# EAGLE design circuito_centrale (EAGLE 9.6.2)
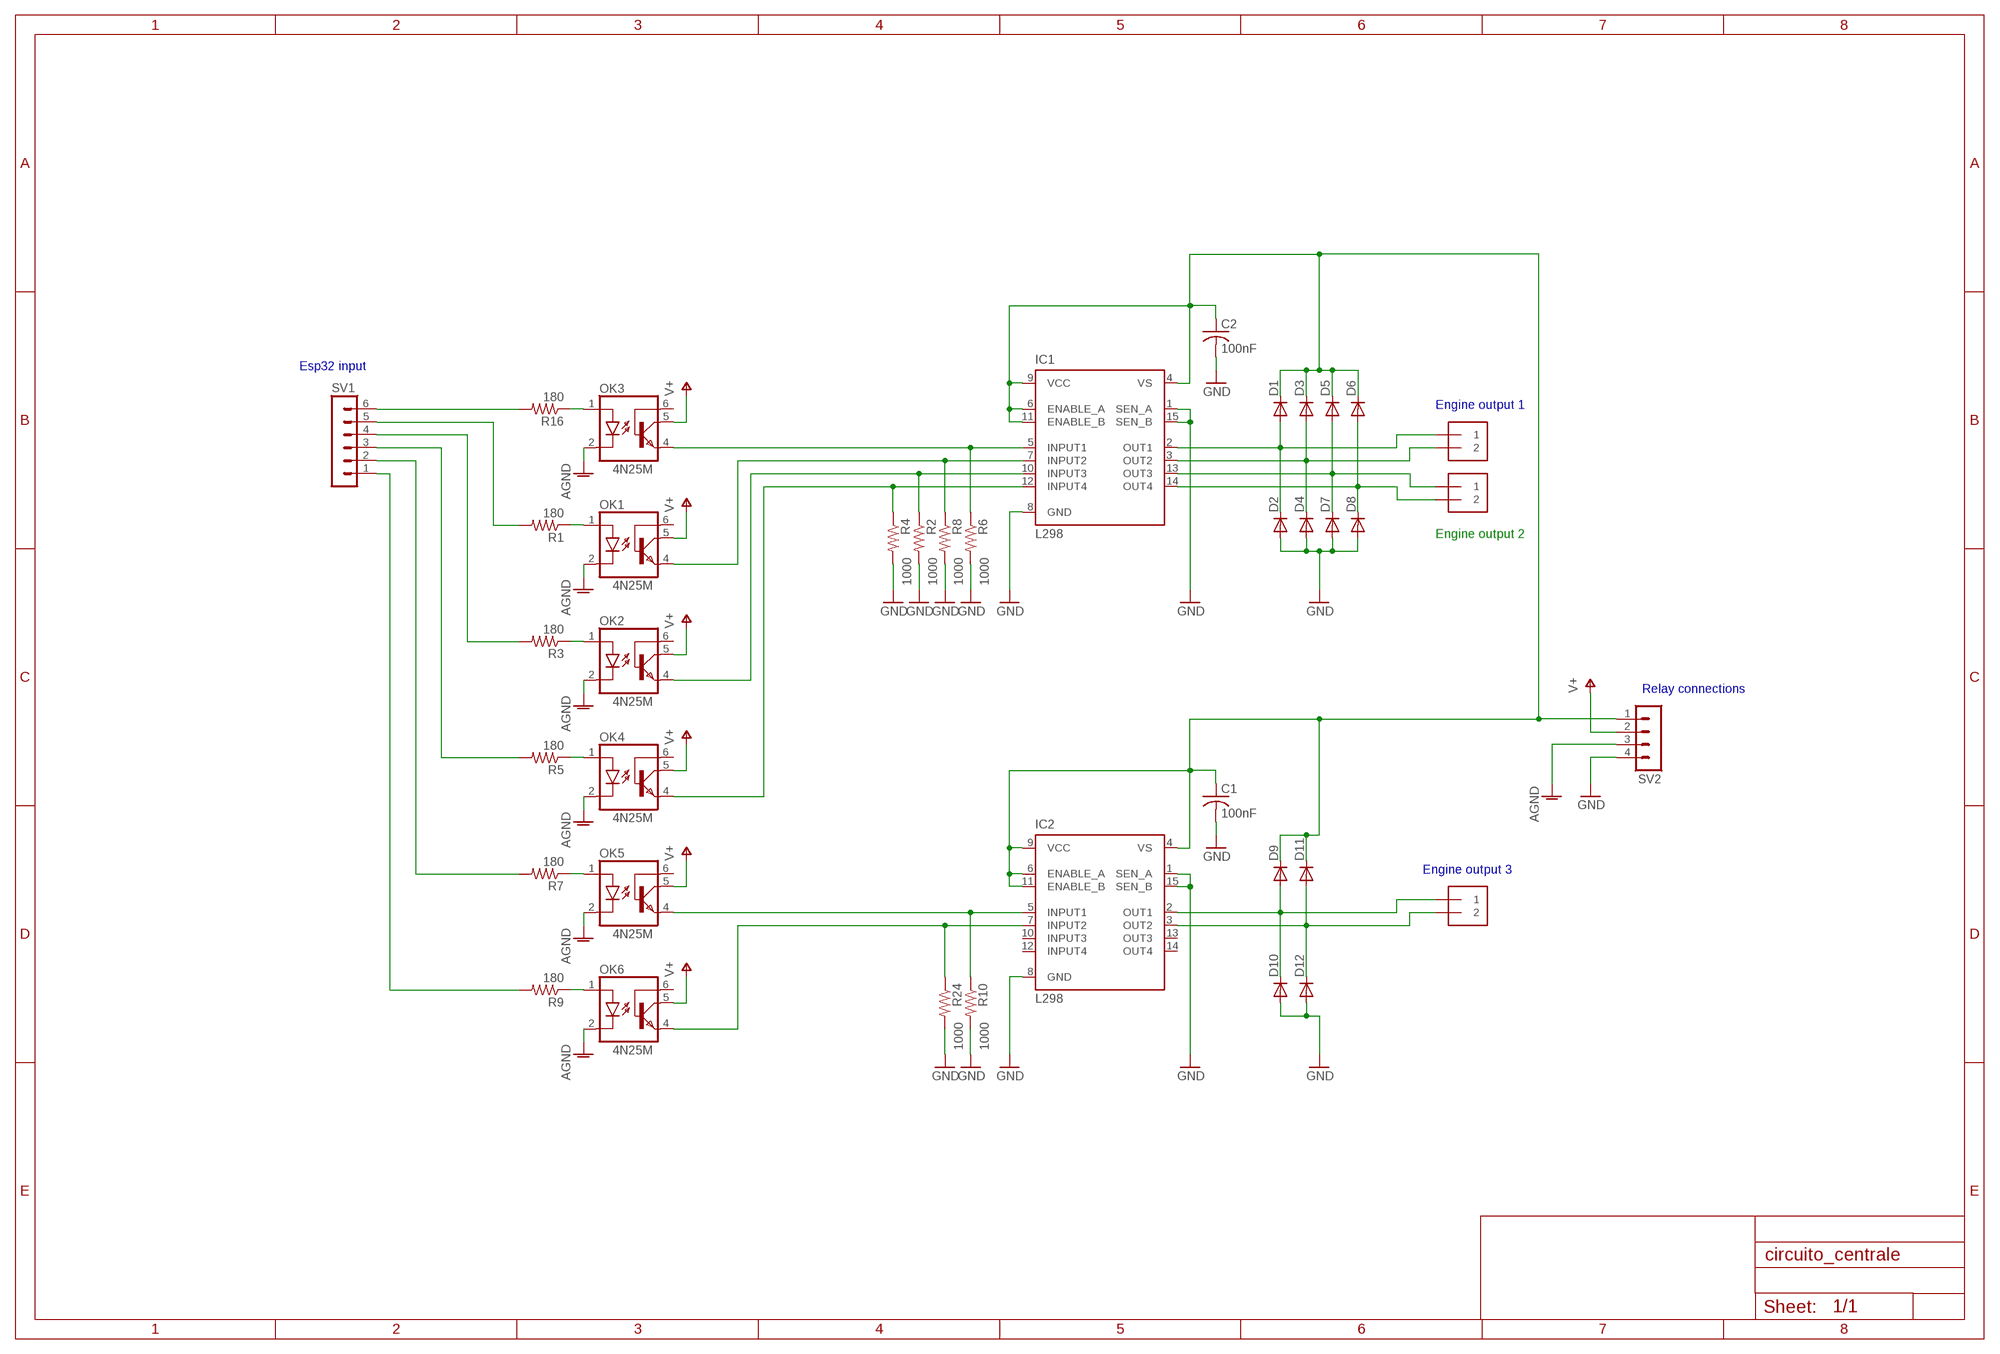
[diagram p0: schematic, sheet 1]

## Parts
C1  100nF  C-US050-024X044  [C050-024X044]
C2  100nF  C-US050-024X044  [C050-024X044]
D1  DIODE-D-5  [D-5]
D2  DIODE-D-5  [D-5]
D3  DIODE-D-5  [D-5]
D4  DIODE-D-5  [D-5]
D5  DIODE-D-5  [D-5]
D6  DIODE-D-5  [D-5]
D7  DIODE-D-5  [D-5]
D8  DIODE-D-5  [D-5]
D9  DIODE-D-5  [D-5]
D10  DIODE-D-5  [D-5]
D11  DIODE-D-5  [D-5]
D12  DIODE-D-5  [D-5]
IC1  L298  [MULTIWATT-15]
IC2  L298  [MULTIWATT-15]
J2  1X2-3.5MM  [1X2-3.5MM]
J3  1X2-3.5MM  [1X2-3.5MM]
J5  1X2-3.5MM  [1X2-3.5MM]
OK1  4N25M  [DIL06]
OK2  4N25M  [DIL06]
OK3  4N25M  [DIL06]
OK4  4N25M  [DIL06]
OK5  4N25M  [DIL06]
OK6  4N25M  [DIL06]
R1  180  R-US_0207/10  [0207/10]
R2  1000  R-US_0207/10  [0207/10]
R3  180  R-US_0207/10  [0207/10]
R4  1000  R-US_0207/10  [0207/10]
R5  180  R-US_0207/10  [0207/10]
R6  1000  R-US_0207/10  [0207/10]
R7  180  R-US_0207/10  [0207/10]
R8  1000  R-US_0207/10  [0207/10]
R9  180  R-US_0207/10  [0207/10]
R10  1000  R-US_0207/10  [0207/10]
R16  180  R-US_0207/10  [0207/10]
R24  1000  R-US_0207/10  [0207/10]
SV1  MA06-1  [MA06-1]
SV2  MA04-1  [MA04-1]

## Nets
AGND [GND1]: OK1.2(C) OK2.2(C) OK3.2(C) OK4.2(C) OK5.2(C) OK6.2(C) SV2.3
GND [GND1]: C1.2 C2.2 D2.A D4.A D7.A D8.A D10.A D12.A IC1.1(SEN_A) IC1.8(GND) IC1.15(SEN_B) IC2.1(SEN_A) IC2.8(GND) IC2.15(SEN_B) R2.2 R4.2 R6.2 R8.2 R10.2 R24.2 SV2.4
N$1: D1.A D2.C IC1.2(OUT1) J2.1
N$2: D3.A D4.C IC1.3(OUT2) J2.2
N$3: D6.A D8.C IC1.14(OUT4) J3.2
N$4: D5.A D7.C IC1.13(OUT3) J3.1
N$6: IC1.5(INPUT1) OK3.4(EMI) R6.1
N$7: OK1.1(A) R1.1
N$8: R1.2 SV1.5
N$9: IC1.7(INPUT2) OK1.4(EMI) R8.1
N$10: IC1.10(INPUT3) OK2.4(EMI) R2.1
N$11: OK2.1(A) R3.1
N$12: R3.2 SV1.4
N$13: IC1.12(INPUT4) OK4.4(EMI) R4.1
N$14: IC2.5(INPUT1) OK5.4(EMI) R10.1
N$15: OK4.1(A) R5.1
N$16: R5.2 SV1.3
N$17: IC2.7(INPUT2) OK6.4(EMI) R24.1
N$19: D9.A D10.C IC2.2(OUT1) J5.1
N$20: D11.A D12.C IC2.3(OUT2) J5.2
N$21: R7.2 SV1.2
N$22: OK3.1(A) R16.1
N$23: R16.2 SV1.6
N$24: R9.2 SV1.1
N$26: OK5.1(A) R7.1
N$29: OK6.1(A) R9.1
N$39: C1.1 C2.1 D1.C D3.C D5.C D6.C D9.C D11.C IC1.4(VS) IC1.6(ENABLE_A) IC1.9(VCC) IC1.11(ENABLE_B) IC2.4(VS) IC2.6(ENABLE_A) IC2.9(VCC) IC2.11(ENABLE_B) SV2.1
V+: OK1.5(COL) OK2.5(COL) OK3.5(COL) OK4.5(COL) OK5.5(COL) OK6.5(COL) SV2.2
Unconnected: IC2.10(INPUT3) IC2.12(INPUT4) IC2.13(OUT3) IC2.14(OUT4) OK1.6(BAS) OK2.6(BAS) OK3.6(BAS) OK4.6(BAS) OK5.6(BAS) OK6.6(BAS)

## Notes on the sheet
- Esp32 input
- Engine output 1
- Engine output 2
- Relay connections
- Engine output 3

## Library data of the parts
C1 C2 = rcl:C-US: CAPACITOR, American symbol
D1-D12 = diode:DIODE-: DIODE
IC1 IC2 = st-microelectronics:L298: DUAL FULL-BRIDGE DRIVER; MPN: L298N; OC_FARNELL: 1589425; OC_NEWARK: 32M1527
J2 J3 J5 = adafruit:1X2: 3.5mm Terminal block http://www.ladyada.net/library/pcb/eaglelibrary.html
OK1-OK6 = optocoupler:4N*?M: General Purpose 6-Pin Phototransistor Optocouplers Source: http://www.fairchildsemi.com/ds/4N/4N35-M.pdf; MPN: 4N25-M; OC_FARNELL: 1021349; OC_NEWARK: 98K9084
R1-R10 R16 R24 = rcl:R-US_: RESISTOR, American symbol; SPICEPREFIX: R
SV1 = con-lstb:MA06-1: PIN HEADER; OC_FARNELL: unknown; OC_NEWARK: unknown
SV2 = con-lstb:MA04-1: PIN HEADER; OC_FARNELL: unknown; OC_NEWARK: unknown

## Net classes
0 default: clearance 0.205 mm
1 GND1: clearance 0.205 mm to class 0, clearance 0.205 mm

## Board
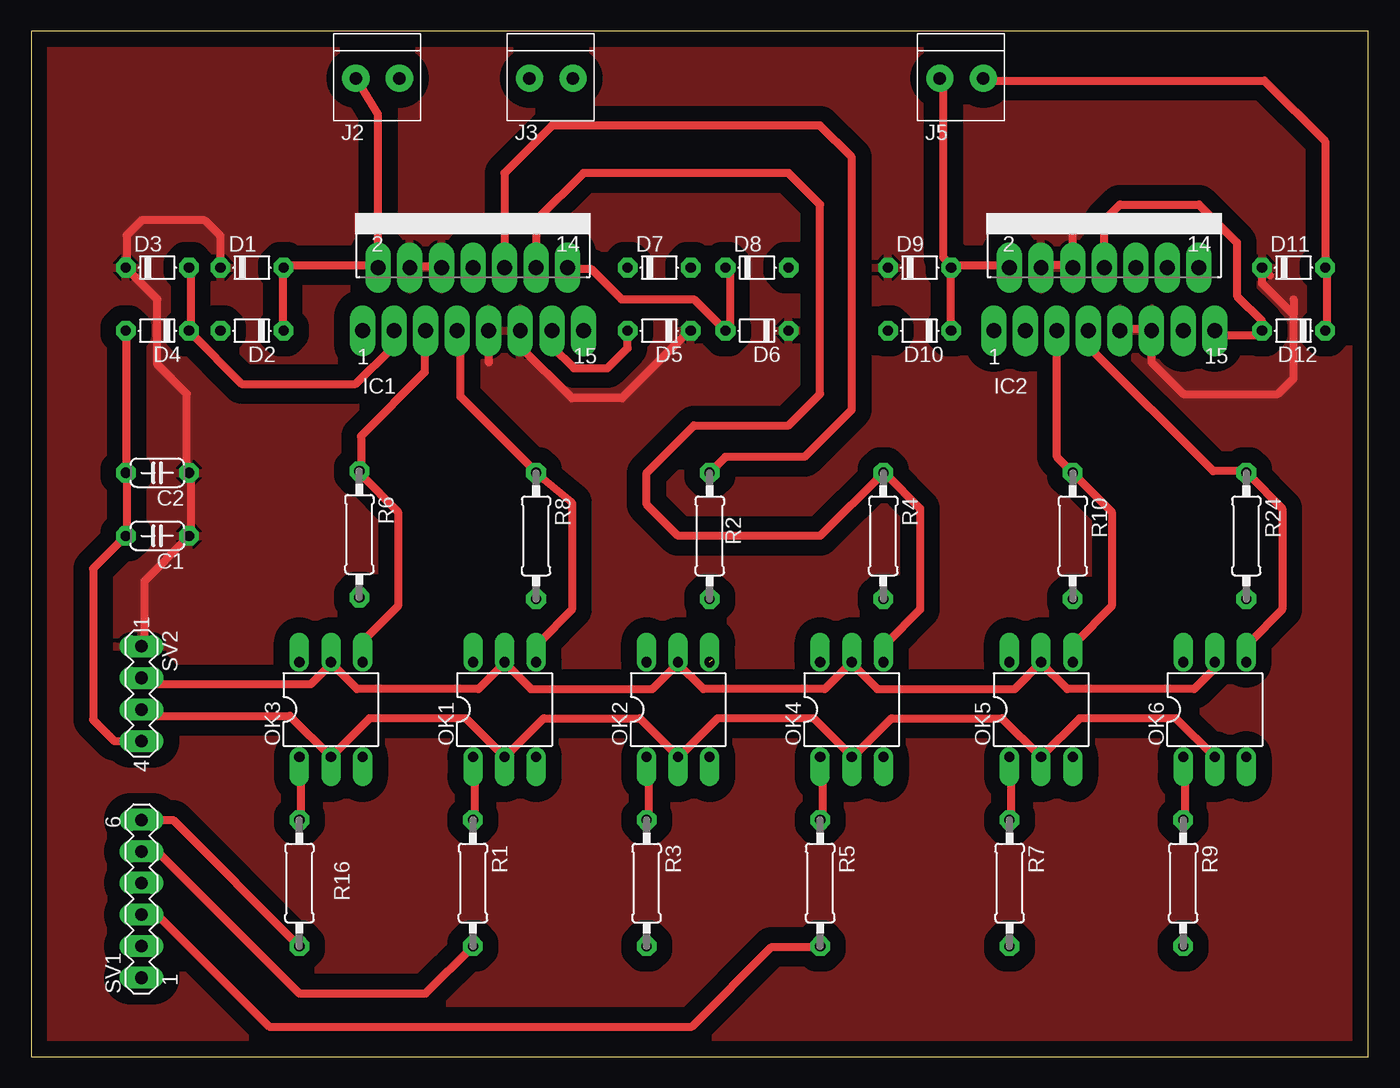
[diagram p1: board, top side]
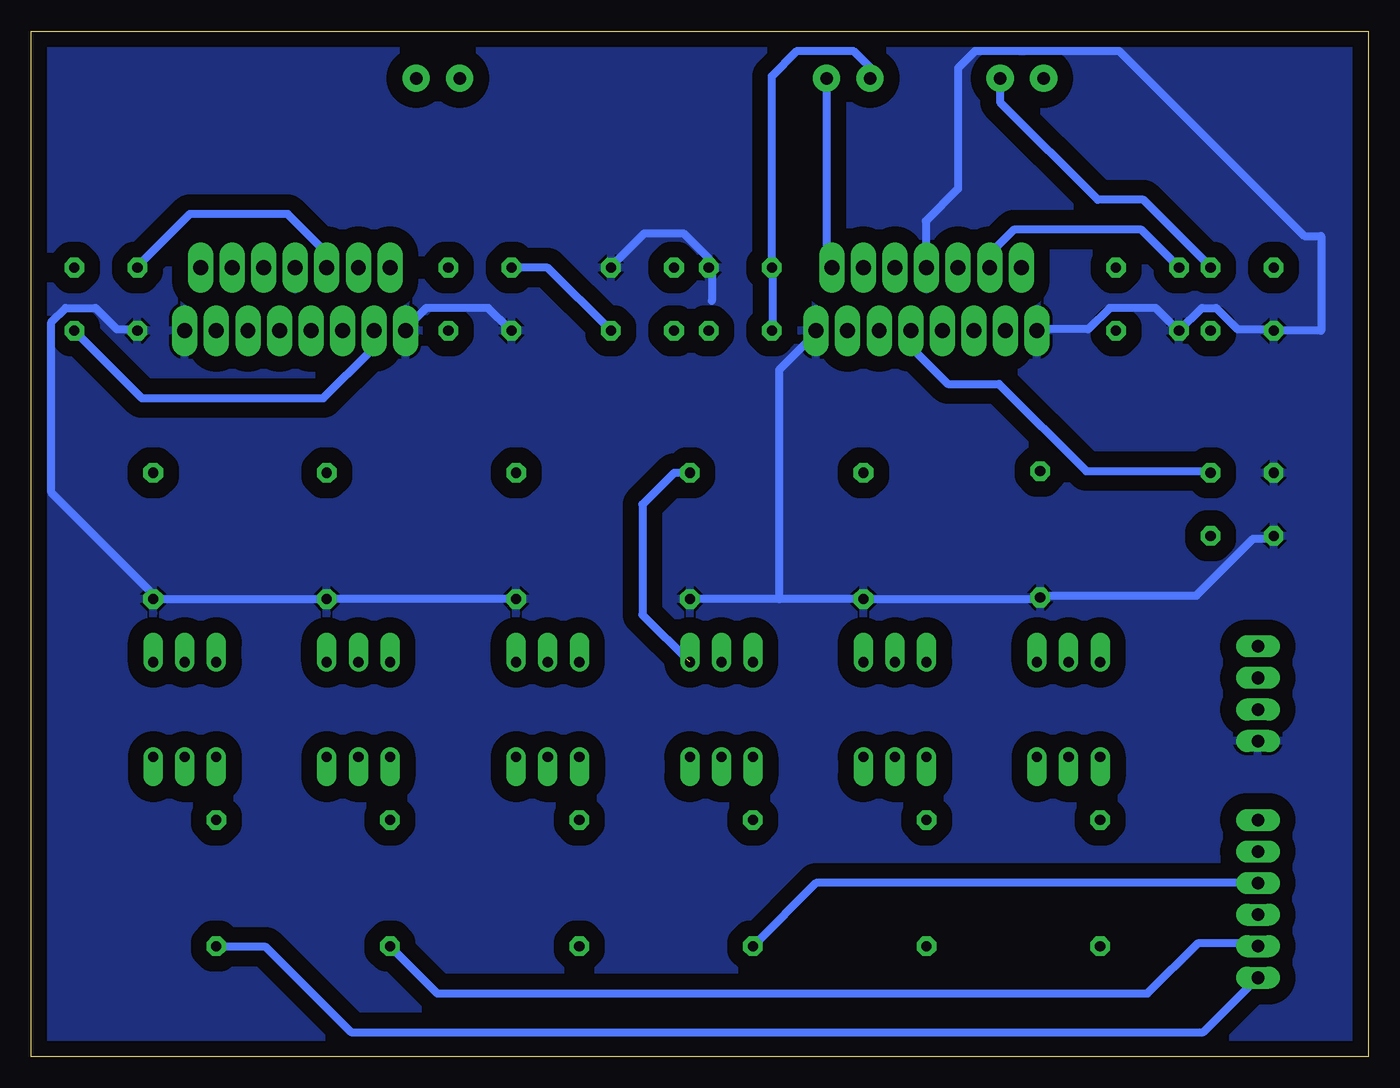
[diagram p2: board, bottom side, seen from below]

Size 107.62 x 82.54 mm. Coordinates in mm from the lower left corner, seen from the top.
Outline: 0,0 107.62,0 107.62,82.54 0,82.54 0,0
Copper layers (1*16): Top 0.035mm / dielectric 1.5mm / Bottom 0.035mm
Design rules "default *": minimum track width 25mil, minimum drill 0.35mm, track to track 20mil, track to pad 20mil, pad to pad 20mil, via to via 20mil, smd to smd 6mil, copper to edge 40mil, drill to drill 6mil, minimum pad ring 15mil, minimum via ring 15mil, stop-mask expansion 4mil, vias tented up to drill 0mil, thermal gap 10mil

### Footprints (pad centres in the part's own frame; a part is rotated, then mirrored left to right if it is on the bottom)
C050-024X044 = drill 0.813 octagon: 1 -2.54,0; 2 2.54,0
D-5 = drill 0.813 octagon: A 2.54,0; C -2.54,0
MULTIWATT-15 = drill 1.2 long: 1 -8.89,-7.62; 2 -7.62,-2.54; 3 -6.35,-7.62; 4 -5.08,-2.54; 5 -3.81,-7.62; 6 -2.54,-2.54; 7 -1.27,-7.62; 8 0,-2.54; 9 1.27,-7.62; 10 2.54,-2.54; 11 3.81,-7.62; 12 5.08,-2.54; 13 6.35,-7.62; 14 7.62,-2.54; 15 8.89,-7.62
1X2-3.5MM = drill 1 pad 2.184: 1 1.8,0; 2 -1.7,0
DIL06 = drill 0.813 offset: 1 -2.54,-3.81; 2 0,-3.81; 3 2.54,-3.81; 4 2.54,3.81; 5 0,3.81; 6 -2.54,3.81
0207/10 = drill 0.813 octagon: 1 -5.08,0; 2 5.08,0
MA06-1 = drill 1.016 long: 1 -6.35,0; 2 -3.81,0; 3 -1.27,0; 4 1.27,0; 5 3.81,0; 6 6.35,0
MA04-1 = drill 1.016 long: 1 -3.81,0; 2 -1.27,0; 3 1.27,0; 4 3.81,0

### Placement (x,y rotation side)
C1  10.16,41.91 180 top
C2  10.16,46.99 180 top
D1  17.78,63.5 0 top
D2  17.78,58.42 180 top
D3  10.16,63.5 0 top
D4  10.16,58.42 180 top
D5  50.55,58.42 180 top
D6  58.42,58.42 180 top
D7  50.55,63.5 0 top
D8  58.42,63.5 0 top
D9  71.5,63.5 0 top
D10  71.5,58.42 180 top
D11  101.6,63.5 0 top
D12  101.6,58.42 180 top
IC1  35.56,66.04 0 top
IC2  86.36,66.04 0 top
J2  27.94,78.74 180 top
J3  41.91,78.74 180 top
J5  74.93,78.74 180 top
OK1  38.1,27.94 0 top
OK2  52.07,27.94 0 top
OK3  24.13,27.94 0 top
OK4  66.04,27.94 0 top
OK5  81.28,27.94 0 top
OK6  95.25,27.94 0 top
R1  35.56,13.97 270 top
R2  54.61,41.91 270 top
R3  49.53,13.97 270 top
R4  68.58,41.91 270 top
R5  63.5,13.97 270 top
R6  26.42,42.04 270 top
R7  78.74,13.97 270 top
R8  40.64,41.91 270 top
R9  92.71,13.97 270 top
R10  83.82,41.91 270 top
R16  21.59,13.97 270 top
R24  97.79,41.91 270 top
SV1  8.89,12.7 90 top
SV2  8.89,29.21 270 top

### Tracks (layer width: path | path; a pad name or v marks a point on that pad's centre or on a via)
AGND
  Top 0.635: OK6.2 92.14,27.24 84.39,27.24 OK5.2 81.12,24.26 78.14,27.24 69.25,27.24 66.26,24.26 OK4.2 65.98,24.26 62.99,27.24 55.24,27.24 52.26,24.26 OK2.2 51.98,24.26 48.99,27.24 41.24,27.24 38.26,24.26 OK1.2 34.99,27.24 27.24,27.24 OK3.2 20.83,27.43 9.4,27.43 SV2.3 9.11,27.69
GND
  Top 0.635: SV2.4 6.7,25.4 4.98,27.11 4.98,39.27 C1.2 7.68,41.97 7.68,46.83 C2.2 7.68,47.12 7.68,58.26 D4.A | IC2.15 95.63,58.04 98.68,58.04 D12.A 99.06,59.18 97.03,61.21 97.03,65.53 93.98,68.58 87.63,68.58 86.36,67.31 IC2.8
  Bottom 0.635: D8.A 60.83,63.69 58.26,66.26 55.12,66.26 53.09,64.23 D7.A 52.83,63.41 52.83,60.83 | IC1.15 44.45,58.23 47.4,55.28 47.4,36.83 | IC2.1 77.47,58.61 75.82,60.26 70.83,60.26 69.12,58.55 D10.A | IC1.1 26.54,58.55 22.54,58.55 20.83,60.26 17.11,60.26 15.4,58.55 D2.A 13.4,60.26 12.26,60.26 10.54,58.55 7.68,58.55 D4.A 3.81,58.42 3.81,66.04 5.15,66.04 20.07,80.95 31.63,80.95 33.02,79.56 33.02,69.85 35.62,67.25 35.62,63.56 IC1.8 | 47.4,36.83 R8.2 26.54,36.83 R6.2 26.26,37.12 13.84,37.12 9.27,41.69 7.68,41.69 C1.2 | 47.4,36.83 R2.2 | R4.2 R10.2 R24.2 97.7,37.12 105.98,45.4 105.98,59.12 104.84,60.26 102.43,60.26 100.71,58.55 99.12,58.55 D12.A
  pour Bottom (isolate 1.27): 0,82.55 107.95,82.55 107.95,0 0,0
N$1
  Top 0.635: D2.C 20.26,58.55 20.26,63.41 D1.A 20.54,63.69 27.53,63.69 27.59,63.76 27.69,63.69 | 27.69,63.69 27.91,63.69 27.91,75.87 J2.1 | 27.69,63.69 IC1.2
N$2
  Top 0.635: D3.A 12.83,63.41 12.83,58.55 D4.C 12.83,58.26 16.95,54.13 26.13,54.13 29.11,57.12 29.11,58.26 IC1.3
  Bottom 0.635: J2.2 29.64,76.82 21.78,68.96 18.1,68.96 12.83,63.69 D3.A
N$3
  Top 0.635: D8.C 56.23,63.15 56.23,58.89 D6.A 53.34,60.96 47.5,60.96 45.05,63.41 43.4,63.41 IC1.14 43.69,63.69
  Bottom 0.635: J3.2 43.61,63.93 IC1.14
N$4
  Top 0.635: IC1.13 41.97,58.26 41.97,57.12 43.69,55.4 46.39,55.4 48.01,57.02 D5.A
  Bottom 0.635: D5.A 47.97,58.55 47.97,63.41 D7.C 48.01,78.92 45.97,80.95 41.46,80.95 40.13,79.63 40.13,78.76 J3.1
N$6
  Top 0.635: IC1.5 31.69,58.26 31.69,55.09 26.54,49.94 26.54,47.12 R6.1 26.54,46.83 29.53,43.85 29.53,36.26 26.83,33.56 26.83,31.97 OK3.4
N$7
  Top 0.635: R1.1 35.69,19.11 35.69,23.97 OK1.1
N$8
  Top 0.635: SV1.5 10.16,16.51 21.59,5.08 31.75,5.08 R1.2
N$9
  Top 0.635: OK1.4 40.83,31.97 40.83,33.27 43.53,35.97 43.53,44.58 R8.1 40.55,47.12 34.54,53.12 34.54,58.26 IC1.7
N$10  (1 unrouted)
  Top 0.635: 54.83,32 54.83,31.97 | R2.1 55.88,48.26 62.23,48.26 66.04,52.07 66.04,72.39 63.5,74.93 41.91,74.93 38.1,71.12 IC1.10
  Bottom 0.635: R2.1 55.88,46.99 58.42,44.45 58.42,35.56 OK2.4
N$11
  Top 0.635: R3.1 49.69,19.11 49.69,23.97 OK2.1
N$12
  Bottom 0.635: SV1.4 44.45,13.97 R3.2
N$13
  Top 0.635: OK4.4 68.83,31.97 68.83,33.27 71.53,35.97 71.53,44.13 68.83,46.83 R4.1 | 40.55,63.69 IC1.12 40.64,67.31 44.45,71.12 60.96,71.12 63.5,68.58 63.5,53.34 60.96,50.8 53.34,50.8 49.53,46.99 49.53,44.45 52.07,41.91 63.5,41.91 R4.1 | 68.55,47.12 R4.1
N$14
  Top 0.635: OK5.4 83.98,31.97 83.98,33.27 86.96,36.26 86.96,43.85 R10.1 82.55,48.26 IC2.5
N$15
  Top 0.635: R5.1 63.69,19.11 63.69,23.97 OK4.1
N$16
  Top 0.635: R5.2 63.41,8.83 59.59,8.83 53.18,2.41 19.18,2.41 10.16,11.43 SV1.3
N$17
  Top 0.635: OK6.4 97.98,31.97 97.98,33.27 100.68,35.97 100.68,44.13 97.98,46.83 R24.1 97.7,47.12 95.12,47.12 85.12,57.12 85.12,58.26 IC2.7
N$19
  Top 0.635: D10.C 73.98,58.55 73.98,63.41 D9.A | IC2.2 78.55,63.69 74.26,63.69 D9.A | J5.1 73.41,78.55 73.41,64.33 74.1,63.63 D9.A
N$20
  Top 0.635: D12.C 104.27,58.55 104.27,63.41 D11.A 104.14,73.66 99.25,78.55 76.84,78.55 J5.2
  Bottom 0.635: D12.C 98.71,52.99 84.11,52.99 80.26,56.83 80.26,58.26 IC2.3
N$21
  Bottom 0.635: 78.55,9.11 R7.2 74.93,5.08 17.78,5.08 13.75,9.11 9.11,9.11 SV1.2
N$22
  Top 0.635: R16.1 21.68,19.11 21.68,23.97 OK3.1
N$23
  Top 0.635: SV1.6 11.43,19.05 R16.2
N$24
  Bottom 0.635: SV1.1 13.27,1.97 81.88,1.97 88.74,8.83 92.55,8.83 R9.2
N$26
  Top 0.635: R7.1 78.84,19.11 78.84,23.97 OK5.1
N$29
  Top 0.635: R9.1 92.84,19.11 92.84,23.97 OK6.1
N$39
  Top 0.635: SV2.1 9.11,33.12 9.11,38.26 12.54,41.69 C1.1 12.83,41.97 12.83,46.83 C2.1 12.54,47.12 12.54,53.34 10.16,55.72 10.16,60.96 D3.C 7.68,63.69 7.68,66.1 8.89,67.31 13.97,67.31 15.24,66.04 D1.C 15.11,63.69 | IC1.4 30.5,63.56 32.96,63.56 IC1.6 | IC2.9 87.69,58.55 89.98,58.55 IC2.11 90.17,55.88 92.71,53.34 100.33,53.34 101.6,54.61 101.6,59.69 | IC2.4 81.41,63.69 83.69,63.69 IC2.6 | 39.4,58.26 39.4,57.12 43.53,52.99 47.56,52.99 52.83,58.26 D5.C | 101.6,60.96 101.6,59.69 | 99.7,62.87 D11.C 99.06,62.23 101.6,59.69 | IC2.6 83.82,64.77 | IC2.6 83.82,66.04 | IC1.9 36.83,55.88
  Bottom 0.635: IC1.4 30.26,63.69 30.26,64.83 28.54,66.55 18.26,66.55 15.4,63.69 D1.C | 98.84,63.41 D11.C 99.06,63.59 94.84,67.82 86.96,67.82 83.98,64.83 83.98,63.69 IC2.6 | 81.12,63.69 IC2.4 | 69.12,63.69 D9.C 66.04,63.5 D6.C | IC1.9 36.83,57.12 33.84,54.13 29.72,54.13 22.7,47.12 12.83,47.12 C2.1
  pour Top (isolate 1.27): 0,82.55 107.95,82.55 107.95,0 0,0 0,81.28
V+
  Top 0.635: OK6.5 95.25,31.24 93.6,29.59 83.38,29.59 81.28,31.69 OK5.5 81.28,31.72 79.15,29.59 68.1,29.59 66.04,31.65 OK4.5 63.88,29.59 54.1,29.59 52.07,31.62 OK2.5 52.07,31.65 50.01,29.59 40.23,29.59 38.1,31.72 OK1.5 38.1,31.69 36.01,29.59 26.23,29.59 24.13,31.69 OK3.5 24.13,31.59 22.51,29.97 9.4,29.97 SV2.2